# EAGLE design 328p-DIP-ISP-adapter (EAGLE 7.1.0)
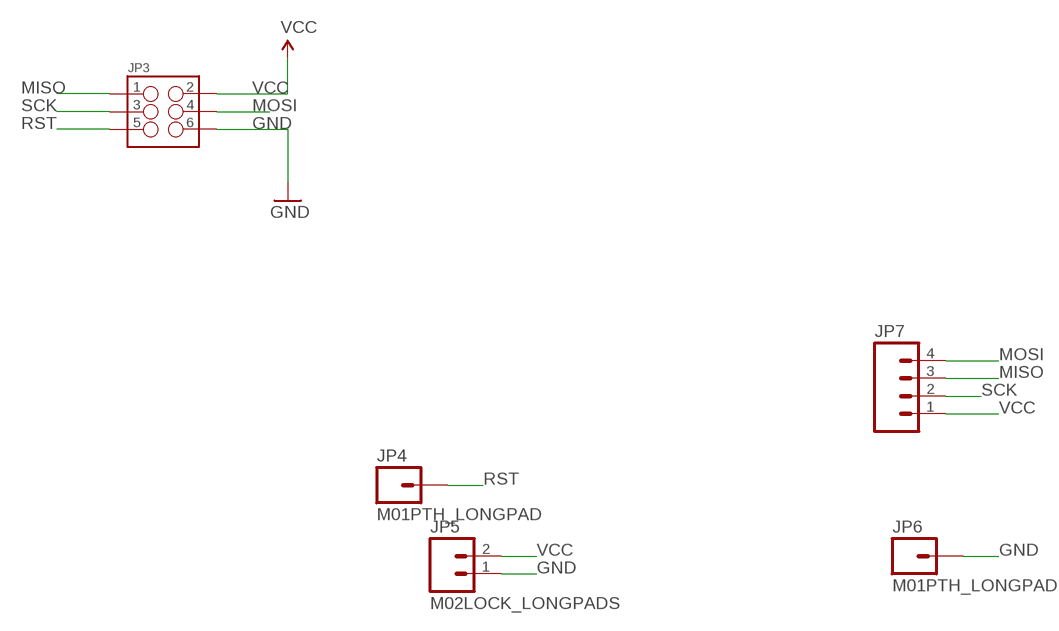
[diagram p0: schematic, sheet 1]

## Parts
JP3  M03X2SMT  [2X3_SMT_POSTS]
JP4  M01PTH_LONGPAD  [1X01_LONGPAD]
JP5  M02LOCK_LONGPADS  [1X02_LOCK_LONGPADS]
JP6  M01PTH_LONGPAD  [1X01_LONGPAD]
JP7  M04LOCK_LONGPADS  [1X04_LOCK_LONGPADS]

## Nets
GND: JP3.6 JP5.1 JP6.1
MISO: JP3.1 JP7.3
MOSI: JP3.4 JP7.4
RST: JP3.5 JP4.1
SCK: JP3.3 JP7.2
VCC: JP3.2 JP5.2 JP7.1

## Library data of the parts
JP3 = SparkFun-Connectors:M03X2: 2x3 .1" header. Shrouded, with keying- CONN-10681 SMT- CONN-11415 Pogo pins- HW-11044; PROD_ID: CONN-11415
JP4 JP6 = SparkFun-Connectors:M01: Header 1 Standard 1-pin 0.1" header. Use with straight break away headers (SKU : PRT-00116), right angle break away headers (PRT-00553), swiss pins (PRT-00743), machine pins (PRT-00117), and female headers (PRT-00115).
JP5 = SparkFun-Connectors:M02: Standard 2-pin 0.1" header. Use with - straight break away headers ( PRT-00116) - right angle break away headers (PRT-00553) - swiss pins (PRT-00743) - machine pins (PRT-00117) - female headers (PRT-00115) Molex polarized connector foot print use with: PRT-08233 with associated crimp pins and housings. 2.54_SCREWTERM for use with PRT-10571. 3.5mm Screw Terminal footprints for PRT-08084 5mm Screw Terminal footprints for use with PRT-08433
JP7 = SparkFun-Connectors:M04: Header 4 Standard 4-pin 0.1" header. Use with straight break away headers (SKU : PRT-00116), right angle break away headers (PRT-00553), swiss pins (PRT-00743), machine pins (PRT-00117), and female headers (PRT-00115). Molex polarized connector foot print use with SKU : PRT-08231 with associated crimp pins and housings. 1MM SMD Version SKU: PRT-10208

## Board
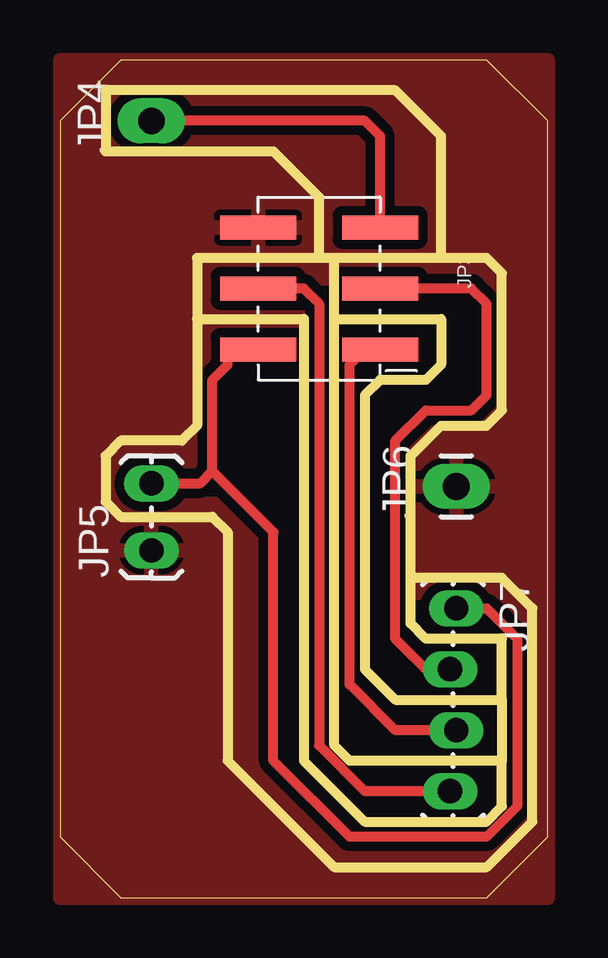
[diagram p1: board, top side]

Size 20.32 x 34.92 mm. Coordinates in mm from the lower left corner, seen from the top.
Outline: 2.54,0 17.78,0 20.32,2.54 20.32,32.38 17.78,34.92 2.54,34.92 0,32.38 0,2.54 2.54,0
Copper layers (1*16): Top 0.035mm / dielectric 1.5mm / Bottom 0.035mm
Design rules "Othermill-DRC-1-64": minimum track width 8mil, minimum drill 0.8mm, track to track 0.39878125mm, track to pad 0.39878125mm, pad to pad 0.39878125mm, via to via 0.39878125mm, smd to smd 0mil, copper to edge 0mil, drill to drill 1mil, minimum pad ring 10mil, minimum via ring 10mil, stop-mask expansion 1mil, vias tented up to drill 30mil, thermal gap 10mil
Milling: 56 lines

### Footprints (pad centres in the part's own frame; a part is rotated, then mirrored left to right if it is on the bottom)
2X3_SMT_POSTS = smd 1 x 3.17: 1 -2.54,-2.54; 2 -2.54,2.54; 3 0,-2.54; 4 0,2.54; 5 2.54,-2.54; 6 2.54,2.54
1X01_LONGPAD = drill 1.118 pad 1.88 long: 1 0,0
1X02_LOCK_LONGPADS = drill 1.016 long: 1 -0.127,0; 2 2.667,0
1X04_LOCK_LONGPADS = drill 1.016 long: 1 0,0; 2 2.54,-0.254; 3 5.08,0; 4 7.62,-0.254

### Placement (x,y rotation side)
JP3  10.79,25.4 90 top
JP4  3.81,32.38 90 top
JP5  3.81,14.61 90 top
JP6  16.51,17.14 90 top
JP7  16.51,12.06 270 top

### Tracks (layer width: path | path; a pad name or v marks a point on that pad's centre or on a via)
GND
  pour Top: 0,0 20.32,0 20.32,34.92 0,34.92
MISO
  Top 0.406: JP7.3 13.97,6.99 12.06,8.89 12.06,22.23 12.7,22.86 JP3.1
MOSI
  Top 0.406: JP7.4 12.7,4.45 10.79,6.35 10.79,24.77 10.16,25.4 JP3.4
RST
  Top 0.406: JP3.5 13.34,31.75 12.7,32.38 JP4.1
SCK
  Top 0.406: JP7.2 15.24,9.53 13.97,10.79 13.97,19.05 15.24,20.32 17.14,20.32 17.78,20.95 17.78,24.77 17.14,25.4 JP3.3
VCC
  Top 0.406: JP5.2 5.84,17.27 6.35,17.78 | JP7.1 17.78,12.06 19.05,10.79 19.05,3.81 17.78,2.54 12.06,2.54 8.89,5.71 8.89,15.24 6.35,17.78 | 6.35,17.78 6.35,21.59 6.99,22.23 6.99,22.86 JP3.2